# EAGLE schematic logic_1.0 (EAGLE 9.5.2)
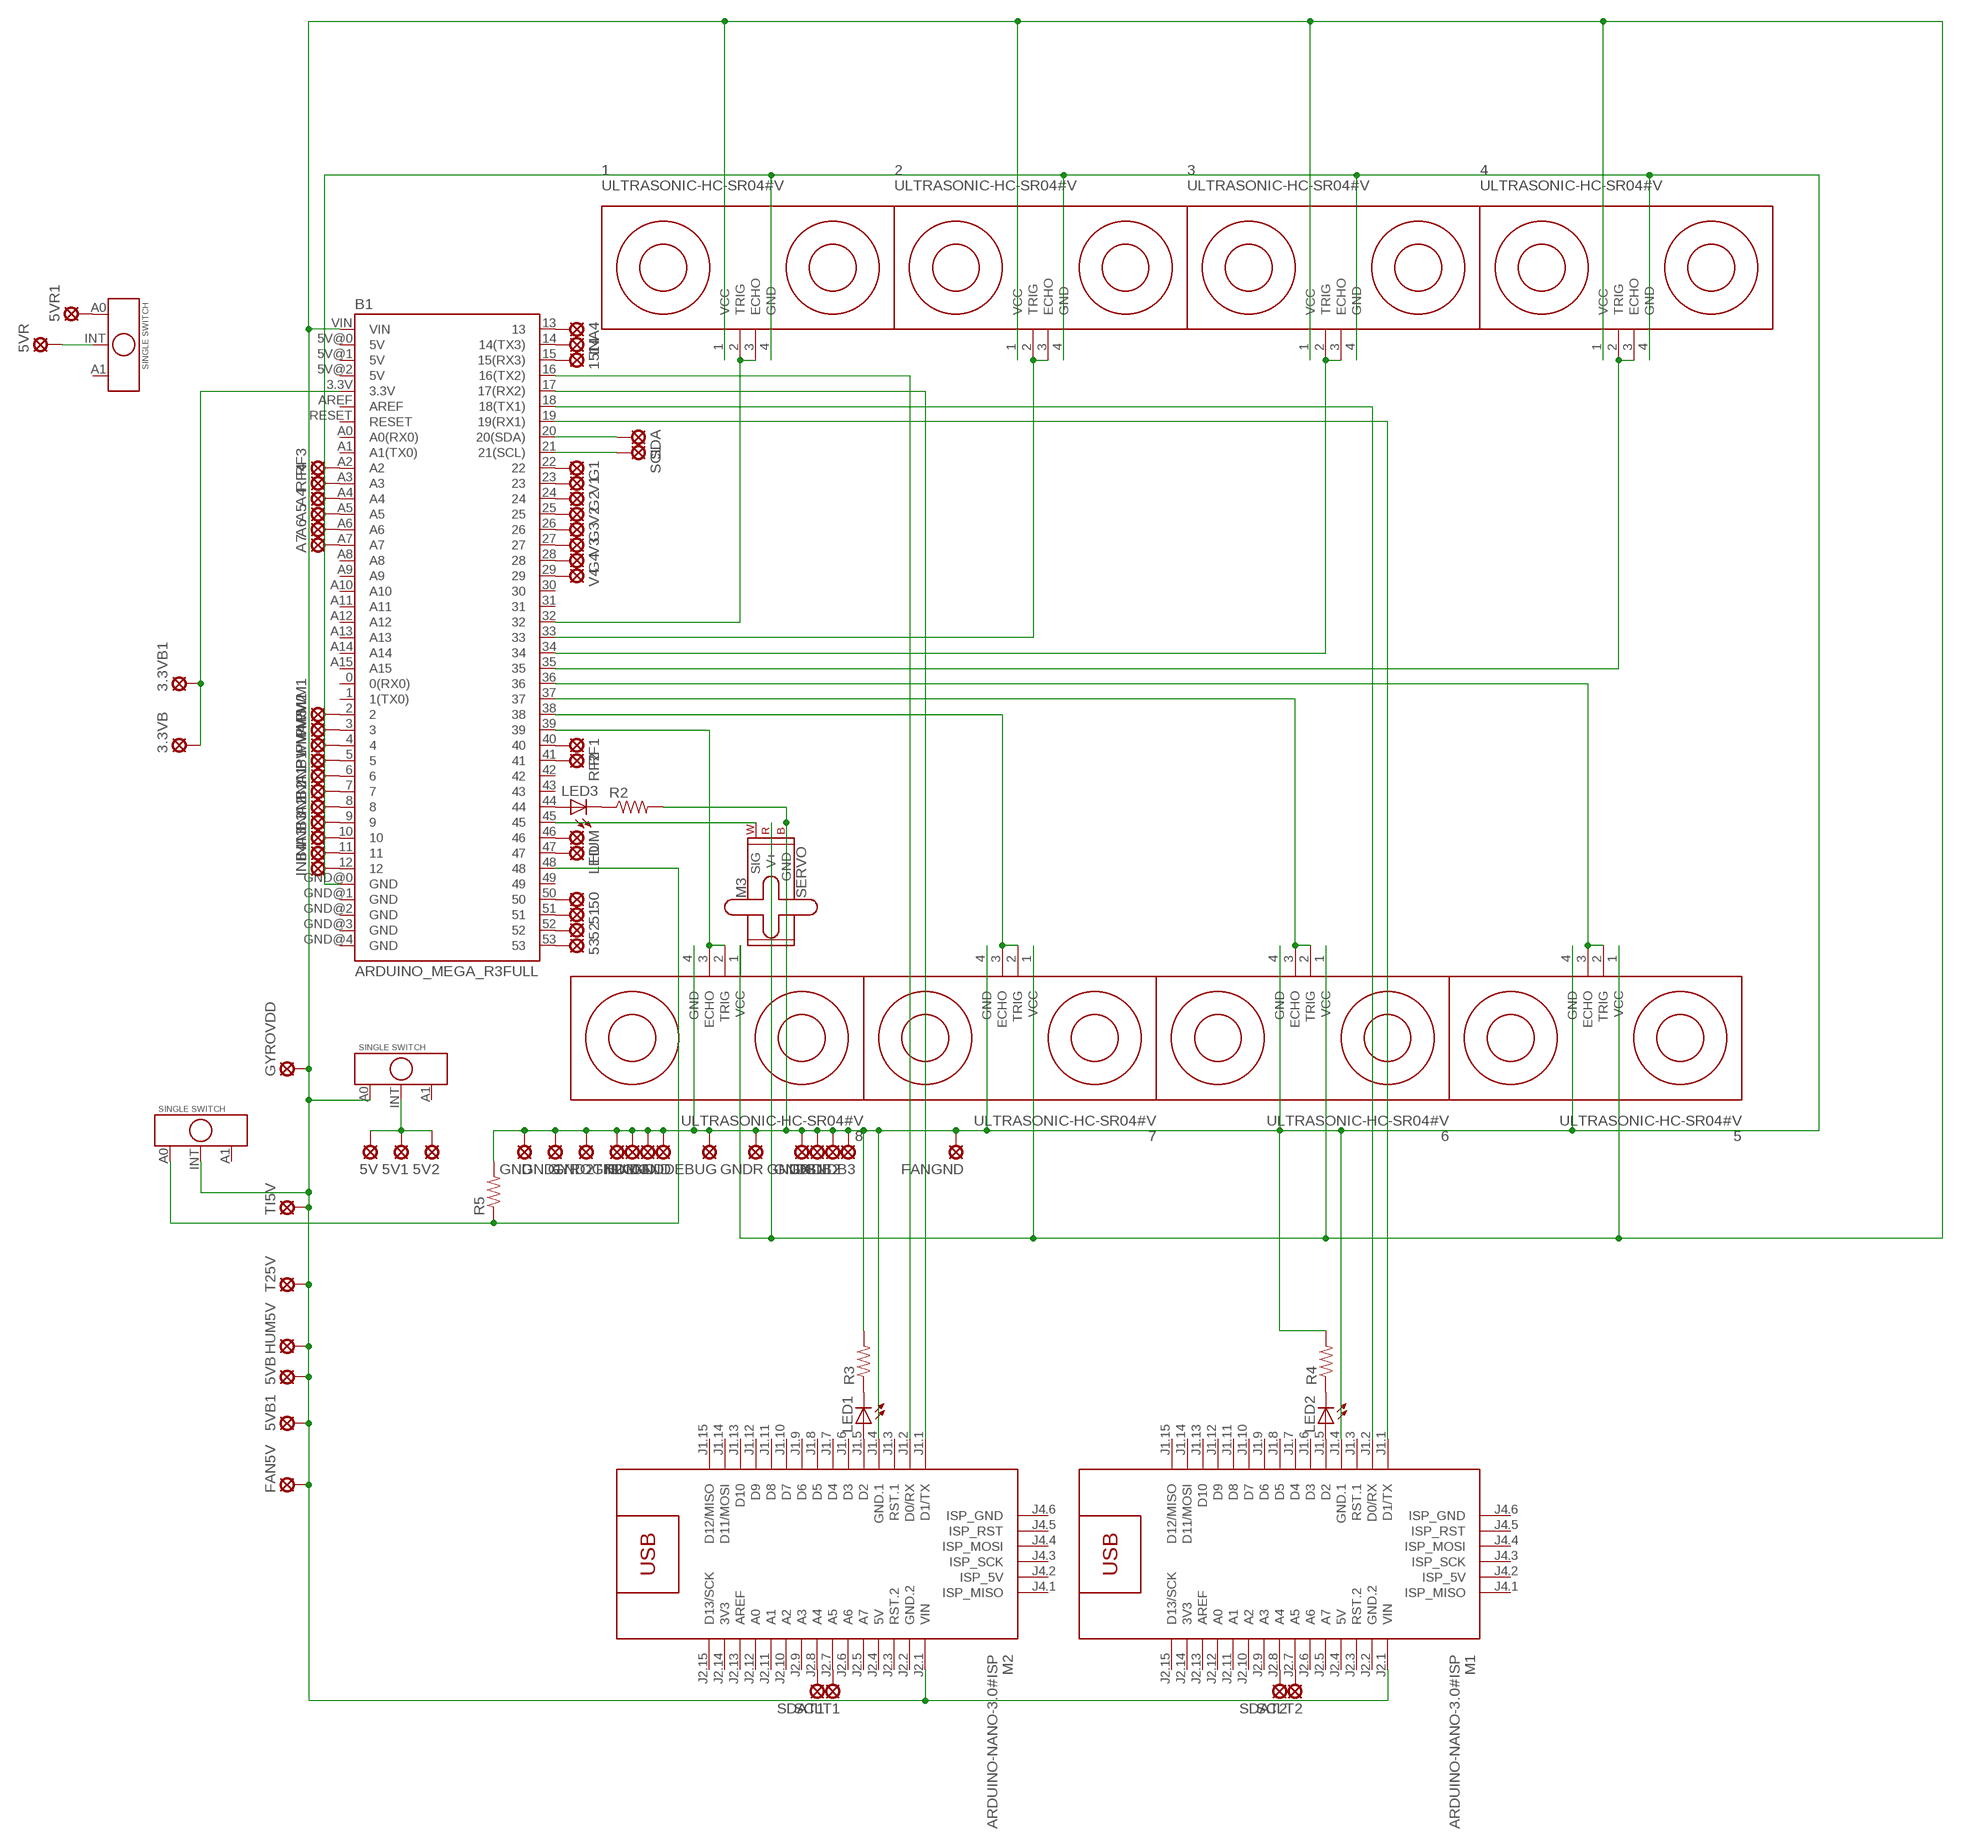
[diagram p0: schematic, sheet 1]

## Parts
1  ULTRASONIC-HC-SR04#V  [ULTRASONIC-HC-SR04#V]
2  ULTRASONIC-HC-SR04#V  [ULTRASONIC-HC-SR04#V]
3  ULTRASONIC-HC-SR04#V  [ULTRASONIC-HC-SR04#V]
3.3VB  LSP10  [LSP10]
3.3VB1  LSP10  [LSP10]
4  ULTRASONIC-HC-SR04#V  [ULTRASONIC-HC-SR04#V]
5  ULTRASONIC-HC-SR04#V  [ULTRASONIC-HC-SR04#V]
5V  LSP10  [LSP10]
5V1  LSP10  [LSP10]
5V2  LSP10  [LSP10]
5VB  LSP10  [LSP10]
5VB1  LSP10  [LSP10]
5VR  LSP10  [LSP10]
5VR1  LSP10  [LSP10]
6  ULTRASONIC-HC-SR04#V  [ULTRASONIC-HC-SR04#V]
7  ULTRASONIC-HC-SR04#V  [ULTRASONIC-HC-SR04#V]
8  ULTRASONIC-HC-SR04#V  [ULTRASONIC-HC-SR04#V]
14  LSP10  [LSP10]
15  LSP10  [LSP10]
50  LSP10  [LSP10]
51  LSP10  [LSP10]
52  LSP10  [LSP10]
53  LSP10  [LSP10]
A4  LSP10  [LSP10]
A5  LSP10  [LSP10]
A6  LSP10  [LSP10]
A7  LSP10  [LSP10]
B1  ARDUINO_MEGA_R3FULL  [ARDUINO_MEGA]
FAN5V  LSP10  [LSP10]
FANGND  LSP10  [LSP10]
G1  LSP10  [LSP10]
G2  LSP10  [LSP10]
G3  LSP10  [LSP10]
G4  LSP10  [LSP10]
GND  LSP10  [LSP10]
GND1  LSP10  [LSP10]
GND2  LSP10  [LSP10]
GNDB  LSP10  [LSP10]
GNDB1  LSP10  [LSP10]
GNDB2  LSP10  [LSP10]
GNDB3  LSP10  [LSP10]
GNDDEBUG  LSP10  [LSP10]
GNDR  LSP10  [LSP10]
GYROGND  LSP10  [LSP10]
GYROVDD  LSP10  [LSP10]
HUM  LSP10  [LSP10]
HUM5V  LSP10  [LSP10]
HUMGND  LSP10  [LSP10]
INA1  LSP10  [LSP10]
INA2  LSP10  [LSP10]
INA3  LSP10  [LSP10]
INA4  LSP10  [LSP10]
INB1  LSP10  [LSP10]
INB2  LSP10  [LSP10]
INB3  LSP10  [LSP10]
INB4  LSP10  [LSP10]
LED  LSP10  [LSP10]
LED1  LED5MM  [LED5MM]
LED2  LED5MM  [LED5MM]
LED3  LED5MM  [LED5MM]
M1  ARDUINO-NANO-3.0#ISP  [ARDUINO-NANO-3.0#ISP]
M2  ARDUINO-NANO-3.0#ISP  [ARDUINO-NANO-3.0#ISP]
M3  SERVO  [1X03]
PWM1  LSP10  [LSP10]
PWM2  LSP10  [LSP10]
PWM3  LSP10  [LSP10]
PWM4  LSP10  [LSP10]
R2  R-US_0207/10  [0207/10]
R3  R-US_0207/10  [0207/10]
R4  R-US_0207/10  [0207/10]
R5  R-US_0207/10  [0207/10]
RF1  LSP10  [LSP10]
RF2  LSP10  [LSP10]
RF3  LSP10  [LSP10]
RF4  LSP10  [LSP10]
SCL  LSP10  [LSP10]
SCLT1  LSP10  [LSP10]
SCLT2  LSP10  [LSP10]
SDA  LSP10  [LSP10]
SDAT1  LSP10  [LSP10]
SDAT2  LSP10  [LSP10]
T2GND  LSP10  [LSP10]
T25V  LSP10  [LSP10]
TI5V  LSP10  [LSP10]
TIGND  LSP10  [LSP10]
U$1  SINGE_SWITCH  [SINGLE_SWITCH]
U$2  SINGE_SWITCH  [SINGLE_SWITCH]
U$3  SINGE_SWITCH  [SINGLE_SWITCH]
V1  LSP10  [LSP10]
V2  LSP10  [LSP10]
V3  LSP10  [LSP10]
V4  LSP10  [LSP10]

## Nets
GND: 1.4(GND) 2.4(GND) 3.4(GND) 4.4(GND) 5.4(GND) 6.4(GND) 7.4(GND) 8.4(GND) B1.GND@0(GND) FANGND.MP GND1.MP GND2.MP GND.MP GNDB1.MP GNDB2.MP GNDB3.MP GNDB.MP GNDDEBUG.MP GNDR.MP GYROGND.MP HUMGND.MP M1.J1.4(GND.1) M2.J1.4(GND.1) M3.3(GND) R2.2 R3.2 R4.2 R5.2 T2GND.MP TIGND.MP
N$1: 5VR1.MP U$2.A0
N$2 [New Class]: 5V1.MP 5V2.MP 5V.MP U$1.INT
N$3: B1.2 PWM1.MP
N$4: B1.16(16(TX2)) M2.J1.2(D0/RX)
N$5: B1.17(17(RX2)) M2.J1.1(D1/TX)
N$6: B1.18(18(TX1)) M1.J1.2(D0/RX)
N$7: B1.19(19(RX1)) M1.J1.1(D1/TX)
N$8: 1.2(TRIG) 1.3(ECHO) B1.32
N$9: 2.2(TRIG) 2.3(ECHO) B1.33
N$10: 3.2(TRIG) 3.3(ECHO) B1.34
N$11: 4.2(TRIG) 4.3(ECHO) B1.35
N$12: 5.2(TRIG) 5.3(ECHO) B1.36
N$13: 6.2(TRIG) 6.3(ECHO) B1.37
N$14: 7.2(TRIG) 7.3(ECHO) B1.38
N$15: 8.2(TRIG) 8.3(ECHO) B1.39
N$18: B1.45 M3.1(SIG)
N$19: 1.1(VCC) 2.1(VCC) 3.1(VCC) 4.1(VCC) 5.1(VCC) 5VB1.MP 5VB.MP 6.1(VCC) 7.1(VCC) 8.1(VCC) B1.VIN FAN5V.MP GYROVDD.MP HUM5V.MP M1.J2.1(VIN) M2.J2.1(VIN) M3.2(V+) T25V.MP TI5V.MP U$1.A0 U$3.INT
N$22: B1.3 PWM2.MP
N$23: B1.4 PWM3.MP
N$24: B1.5 PWM4.MP
N$25: B1.6 INB1.MP
N$26: B1.7 INA1.MP
N$27: B1.8 INB2.MP
N$28: B1.9 INA2.MP
N$29: B1.10 INB3.MP
N$30: B1.11 INA3.MP
N$31: B1.12 INB4.MP
N$32: B1.13 INA4.MP
N$33: B1.22 G1.MP
N$34: B1.23 V1.MP
N$35: B1.24 G2.MP
N$36: B1.25 V2.MP
N$37: B1.26 G3.MP
N$38: B1.27 V3.MP
N$39: B1.28 G4.MP
N$40: B1.29 V4.MP
N$41: B1.20(20(SDA)) SDA.MP
N$42: B1.21(21(SCL)) SCL.MP
N$43: B1.46 HUM.MP
N$44: B1.47 LED.MP
N$45: 3.3VB1.MP 3.3VB.MP B1.3.3V
N$46: M2.J2.8(A4) SDAT1.MP
N$47: M2.J2.7(A5) SCLT1.MP
N$48: M1.J2.8(A4) SDAT2.MP
N$49: M1.J2.7(A5) SCLT2.MP
N$50: B1.40 RF1.MP
N$51: B1.44 LED3.A
N$52: B1.41 RF2.MP
N$53 [New Class]: 5VR.MP U$2.INT
N$54: B1.A2 RF3.MP
N$55: B1.A3 RF4.MP
N$56: LED1.A M2.J1.5(D2)
N$57: LED2.A M1.J1.5(D2)
N$61: LED3.K(C) R2.1
N$62: LED2.K(C) R4.1
N$63: LED1.K(C) R3.1
N$68: 50.MP B1.50
N$69: 51.MP B1.51
N$70: 52.MP B1.52
N$71: A6.MP B1.A6
N$72: A7.MP B1.A7
N$73: A4.MP B1.A4
N$74: A5.MP B1.A5
N$75: 53.MP B1.53
N$80: B1.48 R5.1 U$3.A0
N$81: 14.MP B1.14(14(TX3))
N$82: 15.MP B1.15(15(RX3))
Unconnected: B1.0(0(RX0)) B1.1(1(TX0)) B1.5V@0(5V) B1.5V@1(5V) B1.5V@2(5V) B1.30 B1.31 B1.42 B1.43 B1.49 B1.A0(A0(RX0)) B1.A1(A1(TX0)) B1.A8 B1.A9 B1.A10 B1.A11 B1.A12 B1.A13 B1.A14 B1.A15 B1.AREF B1.GND@1(GND) B1.GND@2(GND) B1.GND@3(GND) B1.GND@4(GND) B1.RESET M1.J1.3(RST.1) M1.J1.6(D3) M1.J1.7(D4) M1.J1.8(D5) M1.J1.9(D6) M1.J1.10(D7) M1.J1.11(D8) M1.J1.12(D9) M1.J1.13(D10) M1.J1.14(D11/MOSI) M1.J1.15(D12/MISO) M1.J2.3(RST.2) M1.J2.5(A7) M1.J2.6(A6) M1.J2.9(A3) M1.J2.10(A2) M1.J2.11(A1) M1.J2.12(A0) M1.J2.13(AREF) M1.J2.15(D13/SCK) M1.J4.1(ISP_MISO) M1.J4.2(ISP_5V) M1.J4.3(ISP_SCK) M1.J4.4(ISP_MOSI) M1.J4.5(ISP_RST) M1.J4.6(ISP_GND) M2.J1.3(RST.1) M2.J1.6(D3) M2.J1.7(D4) M2.J1.8(D5) M2.J1.9(D6) M2.J1.10(D7) M2.J1.11(D8) M2.J1.12(D9) M2.J1.13(D10) M2.J1.14(D11/MOSI) M2.J1.15(D12/MISO) M2.J2.3(RST.2) M2.J2.5(A7) M2.J2.6(A6) M2.J2.9(A3) M2.J2.10(A2) M2.J2.11(A1) M2.J2.12(A0) M2.J2.13(AREF) M2.J2.15(D13/SCK) M2.J4.1(ISP_MISO) M2.J4.2(ISP_5V) M2.J4.3(ISP_SCK) M2.J4.4(ISP_MOSI) M2.J4.5(ISP_RST) M2.J4.6(ISP_GND) U$1.A1 U$2.A1 U$3.A1

## Power pins joined to a net without a drawn wire
3V3: M1.J2.14(3V3) M2.J2.14(3V3)
5V: M1.J2.4(5V) M2.J2.4(5V)
GND.2: M1.J2.2(GND.2) M2.J2.2(GND.2)

## Library data of the parts
1-8 = diy-modules:ULTRASONIC-HC-SR04: Ultrasonic Ranging Module HC-SR04 More details available here: http://randomnerdtutorials.com/complete-guide-for-ultrasonic-sensor-hc-sr04/ Click here to find device on ebay.com <http://www.ebay.com/sch/hc+sr04+ultrasonic>
3.3VB 3.3VB1 5V 5V1 5V2 5VB 5VB1 5VR 5VR1 14 15 50-53 A4-A7 FAN5V FANGND G1-G4 GND GND1 GND2 GNDB GNDB1-GNDB3 GNDDEBUG GNDR GYROGND GYROVDD HUM HUM5V HUMGND INA1-INA4 INB1-INB4 LED PWM1-PWM4 RF1-RF4 SCL SCLT1 SCLT2 SDA SDAT1 SDAT2 T2GND T25V TI5V TIGND V1-V4 = solpad:LSP10: SOLDER PAD drill 1.0 mm, distributor Buerklin, 12H555
B1 = SparkFun-Boards:ARDUINO_MEGA_R3: Arduino Mega R3 ATmega2560 R3 compatible footprint. SparkFun Products: Arduino Mega 2560 R3 <https://www.sparkfun.com/products/11061>
LED1-LED3 = adafruit:LED: LED OSRAM: - CHIPLED LG R971, LG N971, LY N971, LG Q971, LY Q971, LO R971, LY R971 LH N974, LH R974 LS Q976, LO Q976, LY Q976 LO Q996 - Hyper CHIPLED LW Q18S LB Q993, LB Q99A, LB R99A - SideLED LS A670, LO A670, LY A670, LG A670, LP A670 LB A673, LV A673, LT A673, LW A673 LH A674 LY A675 LS A676, LA A676, LO A676, LY A676, LW A676 LS A679, LY A679, LG A679 - Hyper Micro SIDELED® LS Y876, LA Y876, LO Y876, LY Y876 LT Y87S - SmartLED LW L88C, LW L88S LB L89C, LB L89S, LG L890 LS L89K, LO L89K, LY L89K LS L896, LA L896, LO L896, LY L896 - TOPLED LS T670, LO T670, LY T670, LG T670, LP T670 LSG T670, LSP T670, LSY T670, LOP T670, LYG T670 LG T671, LOG T671, LSG T671 LB T673, LV T673, LT T673, LW T673 LH T674 LS T676, LA T676, LO T676, LY T676, LB T676, LH T676, LSB T676, LW T676 LB T67C, LV T67C, LT T67C, LS T67K, LO T67K, LY T67K, LW E67C LS E67B, LA E67B, LO E67B, LY E67B, LB E67C, LV E67C, LT E67C LW T67C LS T679, LY T679, LG T679 LS T770, LO T770, LY T770, LG T770, LP T770 LB T773, LV T773, LT T773, LW T773 LH T774 LS E675, LA E675, LY E675, LS T675 LS T776, LA T776, LO T776, LY T776, LB T776 LHGB T686 LT T68C, LB T68C - Hyper Mini TOPLED® LB M676 - Mini TOPLED Santana® LG M470 LS M47K, LO M47K, LY M47K Source: http://www.osram.convergy.de/
M1 M2 = diy-modmod:ARDUINO-NANO-3.0#ISP: Arduino Nano 3.0 (and compatible devices) with ISP pads More details available here: https://www.arduino.cc/en/Main/ArduinoBoardNano Click here to find device on ebay.com <http://www.ebay.com/sch/arduino+nano>
M3 = SparkFun-Electromechanical:SERVO: Servo Motor 3-pin connector for a standard servo motor (voltage supply, ground, and control signal.) SparkFun Products Servo - Generic (Sub-Micro Size) <https://www.sparkfun.com/products/9065> (ROB-09065) Servo - Generic High Torque Continuous Rotation (Standard Size) <https://www.sparkfun.com/products/9347> (ROB-09347) Servo - Generic High Torque (Standard Size) <https://www.sparkfun.com/products/11965> (ROB-11965)
R2-R5 = adafruit:R-US_: RESISTOR, American symbol
U$1-U$3 = CdiClementina:SINGE_SWITCH: Single Switch with 3 pin

## Net classes
0 default: width 0.2 mm, clearance 0.2 mm
2 New Class: width 0.7 mm